# Altium schematic sheet Memory_USB.SchDoc
size A
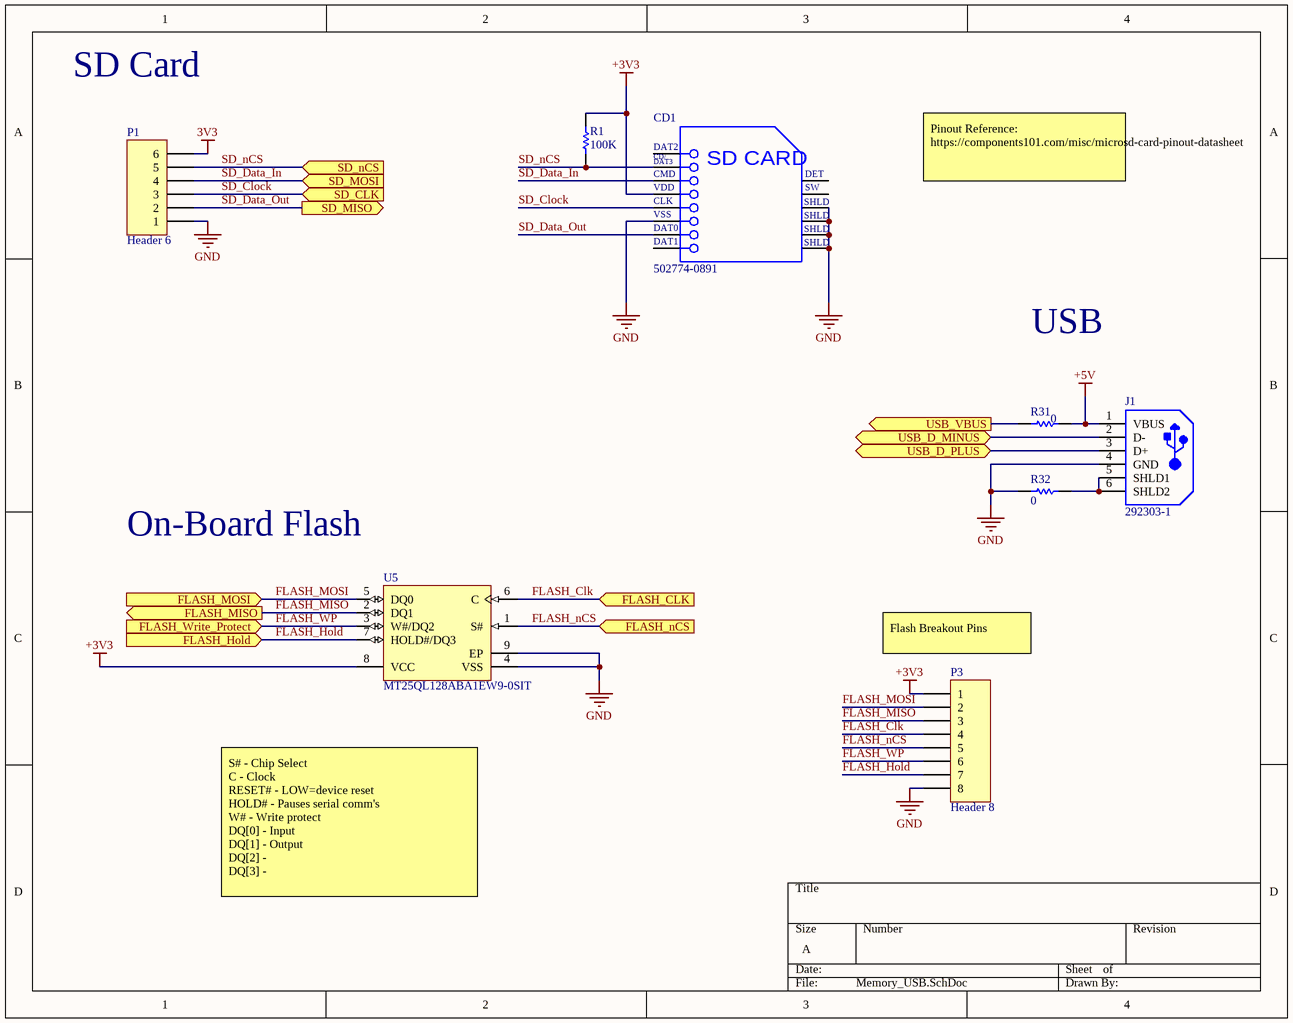
[diagram p0: Memory_USB.SchDoc]

## Parts
CD1  502774-0891  [MOLX-502774-0891_V]
J1  292303-1  [TE-292303-1_V]
P1  Header 6  [HDR1X6]
P3  Header 8  [HDR1X8]
R1  100K  [RESC1608X55X25ML10T15]
R31  0  [RESC1608X55X25ML10T15]
R32  0  [RESC1608X55X25ML10T15]
U5  MT25QL128ABA1EW9-0SIT  [MICT-W9-8_L]

## Ports
FLASH_CLK (in), FLASH_Hold (in), FLASH_MISO (out), FLASH_MOSI (in), FLASH_nCS (in), FLASH_Write_Protect (in), SD_CLK (in), SD_MISO (out), SD_MOSI (in), SD_nCS (in), USB_D_MINUS (bidir), USB_D_PLUS (bidir), USB_VBUS (out)

## Nets
3V3: P1.6
+3V3: CD1.4(VDD) P3.1 R1.2 U5.8(VCC)
+5V: J1.1(VBUS) R31.2
GND: CD1.6(VSS) CD1.11(SHLD) CD1.12(SHLD) CD1.13(SHLD) CD1.14(SHLD) J1.4(GND) P1.1 P3.8 R32.1 U5.4(VSS) U5.9(EP)
FLASH_Clk: P3.4 U5.6(C) ; port FLASH_CLK
FLASH_Hold: P3.7 U5.7(HOLD#/DQ3) ; port FLASH_Hold
FLASH_MISO: P3.3 U5.2(DQ1) ; port FLASH_MISO
FLASH_MOSI: P3.2 U5.5(DQ0) ; port FLASH_MOSI
FLASH_nCS: P3.5 U5.1(S#) ; port FLASH_nCS
FLASH_WP: P3.6 U5.3(W#/DQ2) ; port FLASH_Write_Protect
SD_Clock: CD1.5(CLK) P1.3 ; port SD_CLK
SD_Data_In: CD1.3(CMD) P1.4 ; port SD_MOSI
SD_Data_Out: CD1.7(DAT0) P1.2 ; port SD_MISO
SD_nCS: CD1.2(CD/DAT3) P1.5 R1.1 ; port SD_nCS
USB_D_MINUS: J1.2(D-) ; port USB_D_MINUS
USB_D_PLUS: J1.3(D+) ; port USB_D_PLUS
USB_VBUS: R31.1 ; port USB_VBUS
NetJ1_5: J1.5(SHLD1) J1.6(SHLD2) R32.2

Not connected (* = marked no-connect by the designer): CD1 1(DAT2) 8(DAT1) 9(DETECT) 10(SWITCH)

## Notes on the sheet
- SD Card
- Pinout Reference: https://components101.com/misc/microsd-card-pinout-datasheet
- USB
- On-Board Flash
- (near P3) Flash Breakout Pins
- S# - Chip Select
  C - Clock
  RESET# - LOW=device reset
  HOLD# - Pauses serial comm's
  W# - Write protect
  DQ[0] - Input
  DQ[1] - Output
  DQ[2] -
  DQ[3] -
- (in symbol CMP-2000-05248-1) CD/; DAT3; SD CARD; DET; SW

## Library data of the parts
CD1 = CMP-2000-05248-1: Micro SD Memory Card Connector, 0.5 A, 10 V (DC), -25 to 85 degC, 8-Pin SMT, RoHS, Tape and Reel; Manufacturer: Molex; 3D Model: 502774-0891.stp; Online Catalog: microSD™Series; Number of Positions: 10(8+2); Card Type: SecureDigital-microSD™; Insertion, Removal Method: PushIn,PushOut; Other Names: WM24066DKR; Connector Type: ConnectorandEjector; Features: Switch; Family: MemoryConnectors-PCCardSockets; Manufacturer URL: http://www.molex.com/; Mounting Type: SurfaceMount,RightAngle; Contact Finish Thickness: 20µin(0.51µm); Standard Package: 1; Series: 502774; Ejector Side: -; Datasheet Version: Rev. D, 04/2004; Category: Connectors,Interconnects; Contact Finish: Gold; Datasheet URL: https://datasheet.ciiva.com/1104/1499551-1104671.pdf; RoHS Information: 502774-0891CertofCompliance; Mounting Feature: Reverse-Bottom; Packaging: Digi-Reel; Height Above Board: 0.071"(1.80mm); Catalog Drawings: 502774-0891
J1 = CMP-2000-05404-1: 1 Port Right Angle Through Hole Mount Female Type A USB Connector, 4 Position, -55 to 85 degC, RoHS, Tube; Manufacturer: TE Connectivity; Contact Termination Type: Solder; No. of Contacts: 4; Connector Mounting: PCB; SVHC: NoSVHC(16-Jun-2014); Gender: Receptacle; Connector Type: USBA; Package Description: 4-Pin Through Hole Device, Body 14 x 13.13 mm, Pitch 2.5 mm; Contact Plating: Gold; Package Reference: 292303-1; Contact Material: Copper; Datasheet URL: http://www.farnell.com/cad/1653030.pdf; Datasheet Version: Feb-12; Manufacturer URL: http://www.te.com/
P1 = Header 6: Header, 6-Pin; LatestRevisionDate: 17-Jul-2002; LatestRevisionNote: Re-released for DXP Platform.; Publisher: Altium Limited
P3 = Header 8: Header, 8-Pin; LatestRevisionDate: 17-Jul-2002; LatestRevisionNote: Re-released for DXP Platform.; Publisher: Altium Limited
R1 = CMP-2100-03662-1: Chip Resistor, 100 KOhm, +/- 1%, 0.1 W, -55 to 155 degC, 0603 (1608 Metric), RoHS, Tape and Reel; Manufacturer: Yageo; Power Rating: 100mW; Voltage Rating: 50V; Temperature Coefficient: 100ppm/degreesC; Datasheet Version: Rev. 5, 10/2016; Height: 0.45mm; Lead Free: LeadFree; Manufacturer URL: http://www.yageo.com/; Package Reference: 0603; Depth: 0.8mm; RoHSCompliant: true; Composition: ThickFilm; Military Standard: Not; Resistance: 100KOhm; Case/Package: 0603; Packaging: TapeandReel; Case Code (Imperial): 0603; Voltage Rating (DC): 50V; Case Code (Metric): 1608; Tolerance: 1%; Termination: SMD/SMT; Min Operating Temperature: -55degC; Number of Pins: 2; Length: 1.6mm; Width: 0.8mm; Datasheet URL: http://www.yageo.com/NewPortal/yageodocoutput?fileName=/pdf/R-Chip/PYu-RC_Group_51_RoHS_L_5.pdf; Package Description: 2-Pin Surface Mount Device, Body 1.6 x 0.8 mm; Max Operating Temperature: 155degC; REACH SVHC: NoSVHC
R31 R32 = CMP-2100-03667-1: Chip Resistor, 0 Ohm, +/- 5%, 0.1 W, -55 to 155 degC, 0603 (1608 Metric), RoHS, Tape and Reel; Manufacturer: Yageo; Temperature Coefficient: 200ppm/degreesC; Voltage Rating: 50V; Power Rating: 100mW; Resistance: 0mOhm; Width: 0.8mm; Max Operating Temperature: 155degC; Tolerance: 5%; Package Reference: 0603; Height: 0.45mm; Depth: 0.8mm; Package Description: 2-Pin Surface Mount Device, Body 1.6 x 0.8 mm; Termination: SMD/SMT; Package Quantity: 5000; Case/Package: 0603; Case Code (Imperial): 0603; Radiation Hardening: No; Number of Pins: 2; Length: 1.6mm; Lead Free: LeadFree; Voltage Rating (DC): 50V; Military Standard: Not; Datasheet URL: http://www.yageo.com/NewPortal/yageodocoutput?fileName=/pdf/R-Chip/PYu-RC_Group_51_RoHS_L_5.pdf; Manufacturer URL: http://www.yageo.com/; Packaging: TapeandReel; Case Code (Metric): 1608; Min Operating Temperature: -55degC; Composition: ThickFilm; RoHSCompliant: true; Contact Plating: Tin; Datasheet Version: Rev. 5, 10/2016; REACH SVHC: NoSVHC
U5 = CMP-2000-07470-1: Micron Serial NOR Flash Memory, 2.7 to 3.6 V, 128 Mb, -40 to 85 degC, 8-Pin W-PDFN (W9), RoHS, Tape and Reel; Package Reference: W9; Datasheet URL: https://www.micron.com/~/media/documents/products/data-sheet/nor-flash/serial-nor/mt25q/die-rev-a/mt25q_qlhs_l_128_aba_0.pdf; Package Description: 8-Pin Plastic Dual Flat No-lead Package, Body 8 x 6 mm, Pitch 1.27 mm; RoHSCompliant: false; Datasheet Version: Rev. I , 09/2016; Mounting Technology: SurfaceMount; Manufacturer URL: http://www.micron.com/; Manufacturer: Micron